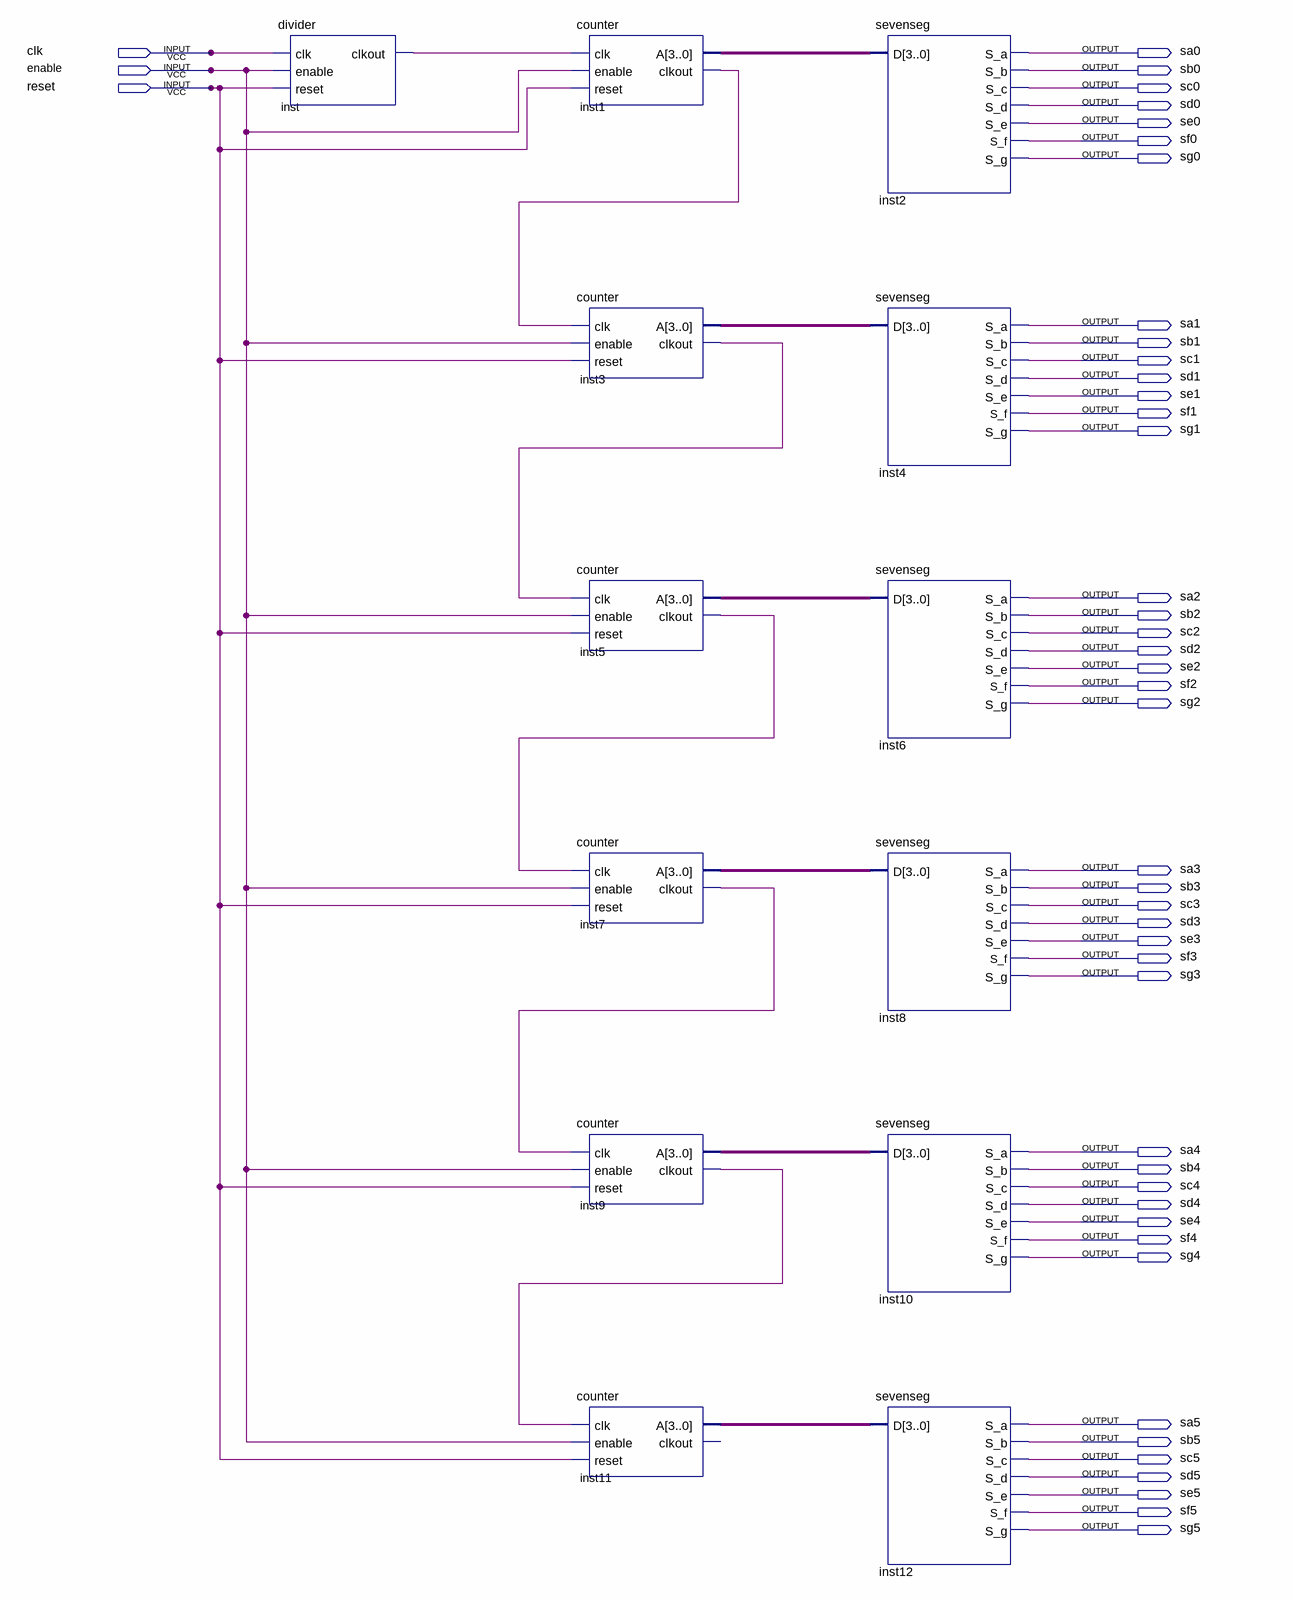
[diagram p0: schematic sheet]
// Quartus schematic lab4.bdf as structural Verilog: 13 symbols, 45 pins
module lab4 (
  input  clk,
  input  enable,
  input  reset,
  output sa0,
  output sb0,
  output sc0,
  output sd0,
  output se0,
  output sf0,
  output sg0,
  output sa1,
  output sb1,
  output sc1,
  output sd1,
  output se1,
  output sf1,
  output sg1,
  output sa2,
  output sb2,
  output sc2,
  output sd2,
  output se2,
  output sf2,
  output sg2,
  output sa3,
  output sb3,
  output sc3,
  output sd3,
  output se3,
  output sf3,
  output sg3,
  output sa4,
  output sb4,
  output sc4,
  output sd4,
  output se4,
  output sf4,
  output sg4,
  output sa5,
  output sb5,
  output sc5,
  output sd5,
  output se5,
  output sf5,
  output sg5
);

  wire inst1_clkout, inst3_clkout, inst5_clkout, inst7_clkout, inst9_clkout, inst_clkout;
  wire [3:0] inst1_a, inst3_a, inst5_a, inst7_a, inst9_a, inst11_a;

  divider inst (.clk(clk), .enable(enable), .reset(reset), .clkout(inst_clkout));
  counter inst1 (.clk(inst_clkout), .enable(enable), .reset(reset), .A(inst1_a), .clkout(inst1_clkout));
  counter inst3 (.clk(inst1_clkout), .enable(enable), .reset(reset), .A(inst3_a), .clkout(inst3_clkout));
  counter inst5 (.clk(inst3_clkout), .enable(enable), .reset(reset), .A(inst5_a), .clkout(inst5_clkout));
  counter inst7 (.clk(inst5_clkout), .enable(enable), .reset(reset), .A(inst7_a), .clkout(inst7_clkout));
  counter inst9 (.clk(inst7_clkout), .enable(enable), .reset(reset), .A(inst9_a), .clkout(inst9_clkout));
  counter inst11 (.clk(inst9_clkout), .enable(enable), .reset(reset), .A(inst11_a));  // open: clkout
  sevenseg inst2 (.D(inst1_a), .S_a(sa0), .S_b(sb0), .S_c(sc0), .S_d(sd0), .S_e(se0), .S_f(sf0), .S_g(sg0));
  sevenseg inst4 (.D(inst3_a), .S_a(sa1), .S_b(sb1), .S_c(sc1), .S_d(sd1), .S_e(se1), .S_f(sf1), .S_g(sg1));
  sevenseg inst6 (.D(inst5_a), .S_a(sa2), .S_b(sb2), .S_c(sc2), .S_d(sd2), .S_e(se2), .S_f(sf2), .S_g(sg2));
  sevenseg inst8 (.D(inst7_a), .S_a(sa3), .S_b(sb3), .S_c(sc3), .S_d(sd3), .S_e(se3), .S_f(sf3), .S_g(sg3));
  sevenseg inst10 (.D(inst9_a), .S_a(sa4), .S_b(sb4), .S_c(sc4), .S_d(sd4), .S_e(se4), .S_f(sf4), .S_g(sg4));
  sevenseg inst12 (.D(inst11_a), .S_a(sa5), .S_b(sb5), .S_c(sc5), .S_d(sd5), .S_e(se5), .S_f(sf5), .S_g(sg5));
endmodule
